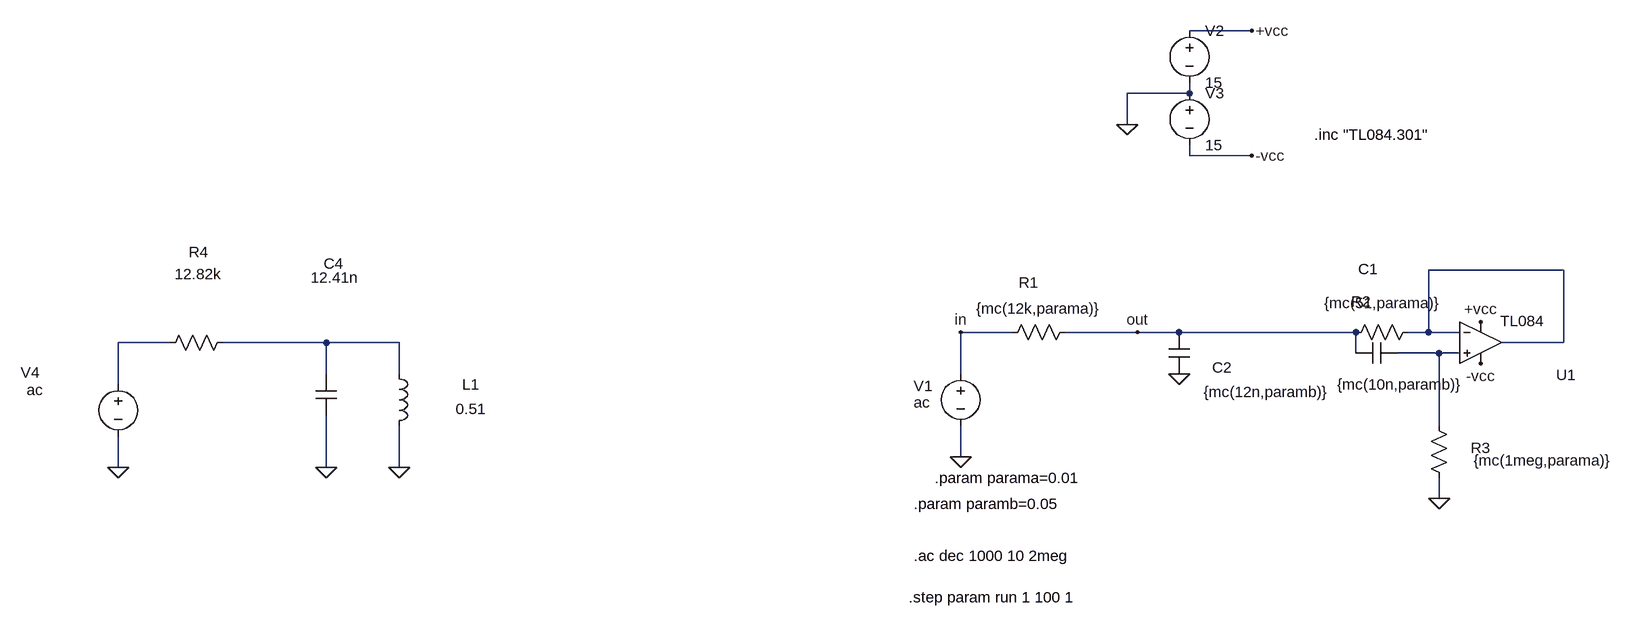
[diagram p0: schematic BP.asc]
BP.asc, the LTspice schematic file:
Version 4
SHEET 1 1580 680
WIRE 816 -368 720 -368
WIRE 720 -272 720 -288
WIRE 720 -272 624 -272
WIRE 624 -224 624 -272
WIRE 720 -176 720 -192
WIRE 816 -176 720 -176
WIRE 1296 0 1088 0
WIRE 448 96 368 96
WIRE 640 96 528 96
WIRE 704 96 640 96
WIRE 976 96 704 96
WIRE 1088 96 1088 0
WIRE 1088 96 1056 96
WIRE 1136 96 1088 96
WIRE -848 112 -928 112
WIRE -608 112 -768 112
WIRE -496 112 -608 112
WIRE 1296 112 1296 0
WIRE 1296 112 1200 112
WIRE 976 128 976 96
WIRE 1104 128 1040 128
WIRE 1136 128 1104 128
WIRE -608 160 -608 112
WIRE -496 160 -496 112
WIRE 368 160 368 96
WIRE -928 176 -928 112
WIRE 1104 240 1104 128
WIRE 368 288 368 240
WIRE -928 304 -928 256
WIRE -608 304 -608 224
WIRE -496 304 -496 240
WIRE 1104 352 1104 320
FLAG 368 288 0
FLAG 816 -368 +vcc
FLAG 1168 80 +vcc
FLAG 816 -176 -vcc
FLAG 1168 144 -vcc
FLAG 624 -224 0
FLAG 368 96 in
FLAG 640 96 out
FLAG 1104 352 0
FLAG 704 160 0
FLAG -928 304 0
FLAG -608 304 0
FLAG -496 304 0
SYMBOL Opamps\\opamp2 1168 48 R0
WINDOW 0 116 114 Left 2
WINDOW 3 30 31 Left 2
SYMATTR InstName U1
SYMATTR Value TL084
SYMBOL voltage 720 -384 R0
SYMATTR InstName V2
SYMATTR Value 15
SYMBOL voltage 720 -288 R0
SYMATTR InstName V3
SYMATTR Value 15
SYMBOL voltage 368 144 R0
WINDOW 123 0 0 Left 0
WINDOW 39 0 0 Left 0
WINDOW 0 -72 35 Left 2
WINDOW 3 -72 60 Left 2
SYMATTR InstName V1
SYMATTR Value ac
SYMBOL res 544 80 R90
WINDOW 0 -45 71 VBottom 2
WINDOW 3 -36 55 VTop 2
SYMATTR InstName R1
SYMATTR Value {mc(12k,parama)}
SYMBOL cap 1040 112 R90
WINDOW 0 -98 45 VBottom 2
WINDOW 3 49 -5 VTop 2
SYMATTR InstName C1
SYMATTR Value {mc(10n,paramb)}
SYMBOL res 1072 80 R90
WINDOW 0 -16 88 VBottom 2
WINDOW 3 -45 54 VTop 2
SYMATTR InstName R2
SYMATTR Value {mc(51,parama)}
SYMBOL res 1088 224 R0
WINDOW 0 65 50 Left 2
WINDOW 3 69 69 Left 2
SYMATTR InstName R3
SYMATTR Value {mc(1meg,parama)}
SYMBOL cap 688 96 R0
WINDOW 0 67 54 Left 2
WINDOW 3 54 92 Left 2
SYMATTR InstName C2
SYMATTR Value {mc(12n,paramb)}
SYMBOL voltage -928 160 R0
WINDOW 123 0 0 Left 0
WINDOW 39 0 0 Left 0
WINDOW 0 -150 -2 Left 2
WINDOW 3 -141 25 Left 2
SYMATTR InstName V4
SYMATTR Value ac
SYMBOL res -752 96 R90
WINDOW 0 -108 52 VBottom 2
WINDOW 3 -105 53 VTop 2
SYMATTR InstName R4
SYMATTR Value 12.82k
SYMBOL cap -624 160 R0
WINDOW 0 12 -170 Left 2
WINDOW 3 -8 -148 Left 2
SYMATTR InstName C4
SYMATTR Value 12.41n
SYMBOL ind -512 144 R0
WINDOW 0 113 32 Left 2
WINDOW 3 103 70 Left 2
SYMATTR InstName L1
SYMATTR Value 0.51
TEXT 296 440 Left 2 !.ac dec 1000 10 2meg
TEXT 912 -208 Left 2 !.inc "TL084.301"
TEXT 328 320 Left 2 !.param parama=0.01
TEXT 296 360 Left 2 !.param paramb=0.05
TEXT 288 504 Left 2 !.step param run 1 100 1

The netlist it stands for:
* BP.asc
XU1 N004 N001 +vcc -vcc N001 TL084  ; pins In+ In- V+ V- OUT
V2 +vcc 0 15
V3 0 -vcc 15
V1 in 0 ac
R1 out in {mc(12k,parama)}
C1 N004 out {mc(10n,paramb)}
R2 N001 out {mc(51,parama)}
R3 N004 0 {mc(1meg,parama)}
C2 out 0 {mc(12n,paramb)}
V4 N002 0 ac
R4 N003 N002 12.82k
C4 N003 0 12.41n
L1 N003 0 0.51
.ac dec 1000 10 2meg
.inc "TL084.301"
.param parama=0.01
.param paramb=0.05
.step param run 1 100 1
.backanno
.end